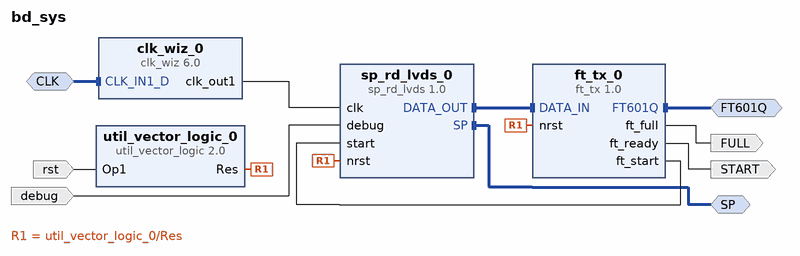
[diagram p0: block diagram of the top level]
# Vivado block design bd_sys, xcvu9p-flga2104-2L-e, Vivado 2019.1
create_bd_design bd_sys

create_bd_intf_port -mode Master -vlnv xilinx.com:user:FT601Q_rtl:1.0 FT601Q
create_bd_intf_port -mode Slave -vlnv xilinx.com:interface:diff_clock_rtl:1.0 CLK
create_bd_intf_port -mode Master -vlnv xilinx.com:user:SuperMario_rtl:1.0 SP
create_bd_port -dir O FULL
create_bd_port -dir I rst
create_bd_port -dir I debug
create_bd_port -dir O START

create_bd_cell -type ip -vlnv xilinx.com:ip:clk_wiz:6.0 clk_wiz_0
set_property -dict [list \
  CONFIG.CLKIN1_JITTER_PS 33.330000000000005 \
  CONFIG.CLKOUT1_JITTER 121.731 \
  CONFIG.CLKOUT1_PHASE_ERROR 77.836 \
  CONFIG.CLKOUT1_REQUESTED_OUT_FREQ 40.000 \
  CONFIG.CLK_IN1_BOARD_INTERFACE default_sysclk1_300 \
  CONFIG.MMCM_CLKFBOUT_MULT_F 4.000 \
  CONFIG.MMCM_CLKIN1_PERIOD 3.333 \
  CONFIG.MMCM_CLKIN2_PERIOD 10.0 \
  CONFIG.MMCM_CLKOUT0_DIVIDE_F 30.000 \
  CONFIG.PRIM_SOURCE Differential_clock_capable_pin \
  CONFIG.USE_LOCKED false \
  CONFIG.USE_RESET false \
] [get_bd_cells clk_wiz_0]
create_bd_cell -type ip -vlnv xilinx.com:ip:util_vector_logic:2.0 util_vector_logic_0
set_property -dict {CONFIG.C_OPERATION not CONFIG.C_SIZE 1} [get_bd_cells util_vector_logic_0]
create_bd_cell -type ip -vlnv xilinx.com:user:ft_tx:1.0 ft_tx_0
create_bd_cell -type ip -vlnv xilinx.com:user:sp_rd_lvds:1.0 sp_rd_lvds_0

# ---- connections ----

connect_bd_intf_net [get_bd_intf_ports SP] [get_bd_intf_pins sp_rd_lvds_0/SP]
connect_bd_intf_net [get_bd_intf_pins sp_rd_lvds_0/DATA_OUT] [get_bd_intf_pins ft_tx_0/DATA_IN]
connect_bd_intf_net -intf_net CLK_IN1_D_0_1 [get_bd_intf_ports CLK] [get_bd_intf_pins clk_wiz_0/CLK_IN1_D]
connect_bd_intf_net [get_bd_intf_ports FT601Q] [get_bd_intf_pins ft_tx_0/FT601Q]
connect_bd_net [get_bd_pins ft_tx_0/ft_full] [get_bd_ports FULL]
connect_bd_net [get_bd_ports rst] [get_bd_pins util_vector_logic_0/Op1]
connect_bd_net [get_bd_pins ft_tx_0/ft_start] [get_bd_pins sp_rd_lvds_0/start]
connect_bd_net -net debug_0_1 [get_bd_ports debug] [get_bd_pins sp_rd_lvds_0/debug]
connect_bd_net [get_bd_pins ft_tx_0/ft_ready] [get_bd_ports START]
connect_bd_net [get_bd_pins clk_wiz_0/clk_out1] [get_bd_pins sp_rd_lvds_0/clk]
connect_bd_net [get_bd_pins util_vector_logic_0/Res] [get_bd_pins ft_tx_0/nrst] [get_bd_pins sp_rd_lvds_0/nrst]

validate_bd_design
save_bd_design
